# EAGLE design relay_dip_v03 (EAGLE 7.7.0)
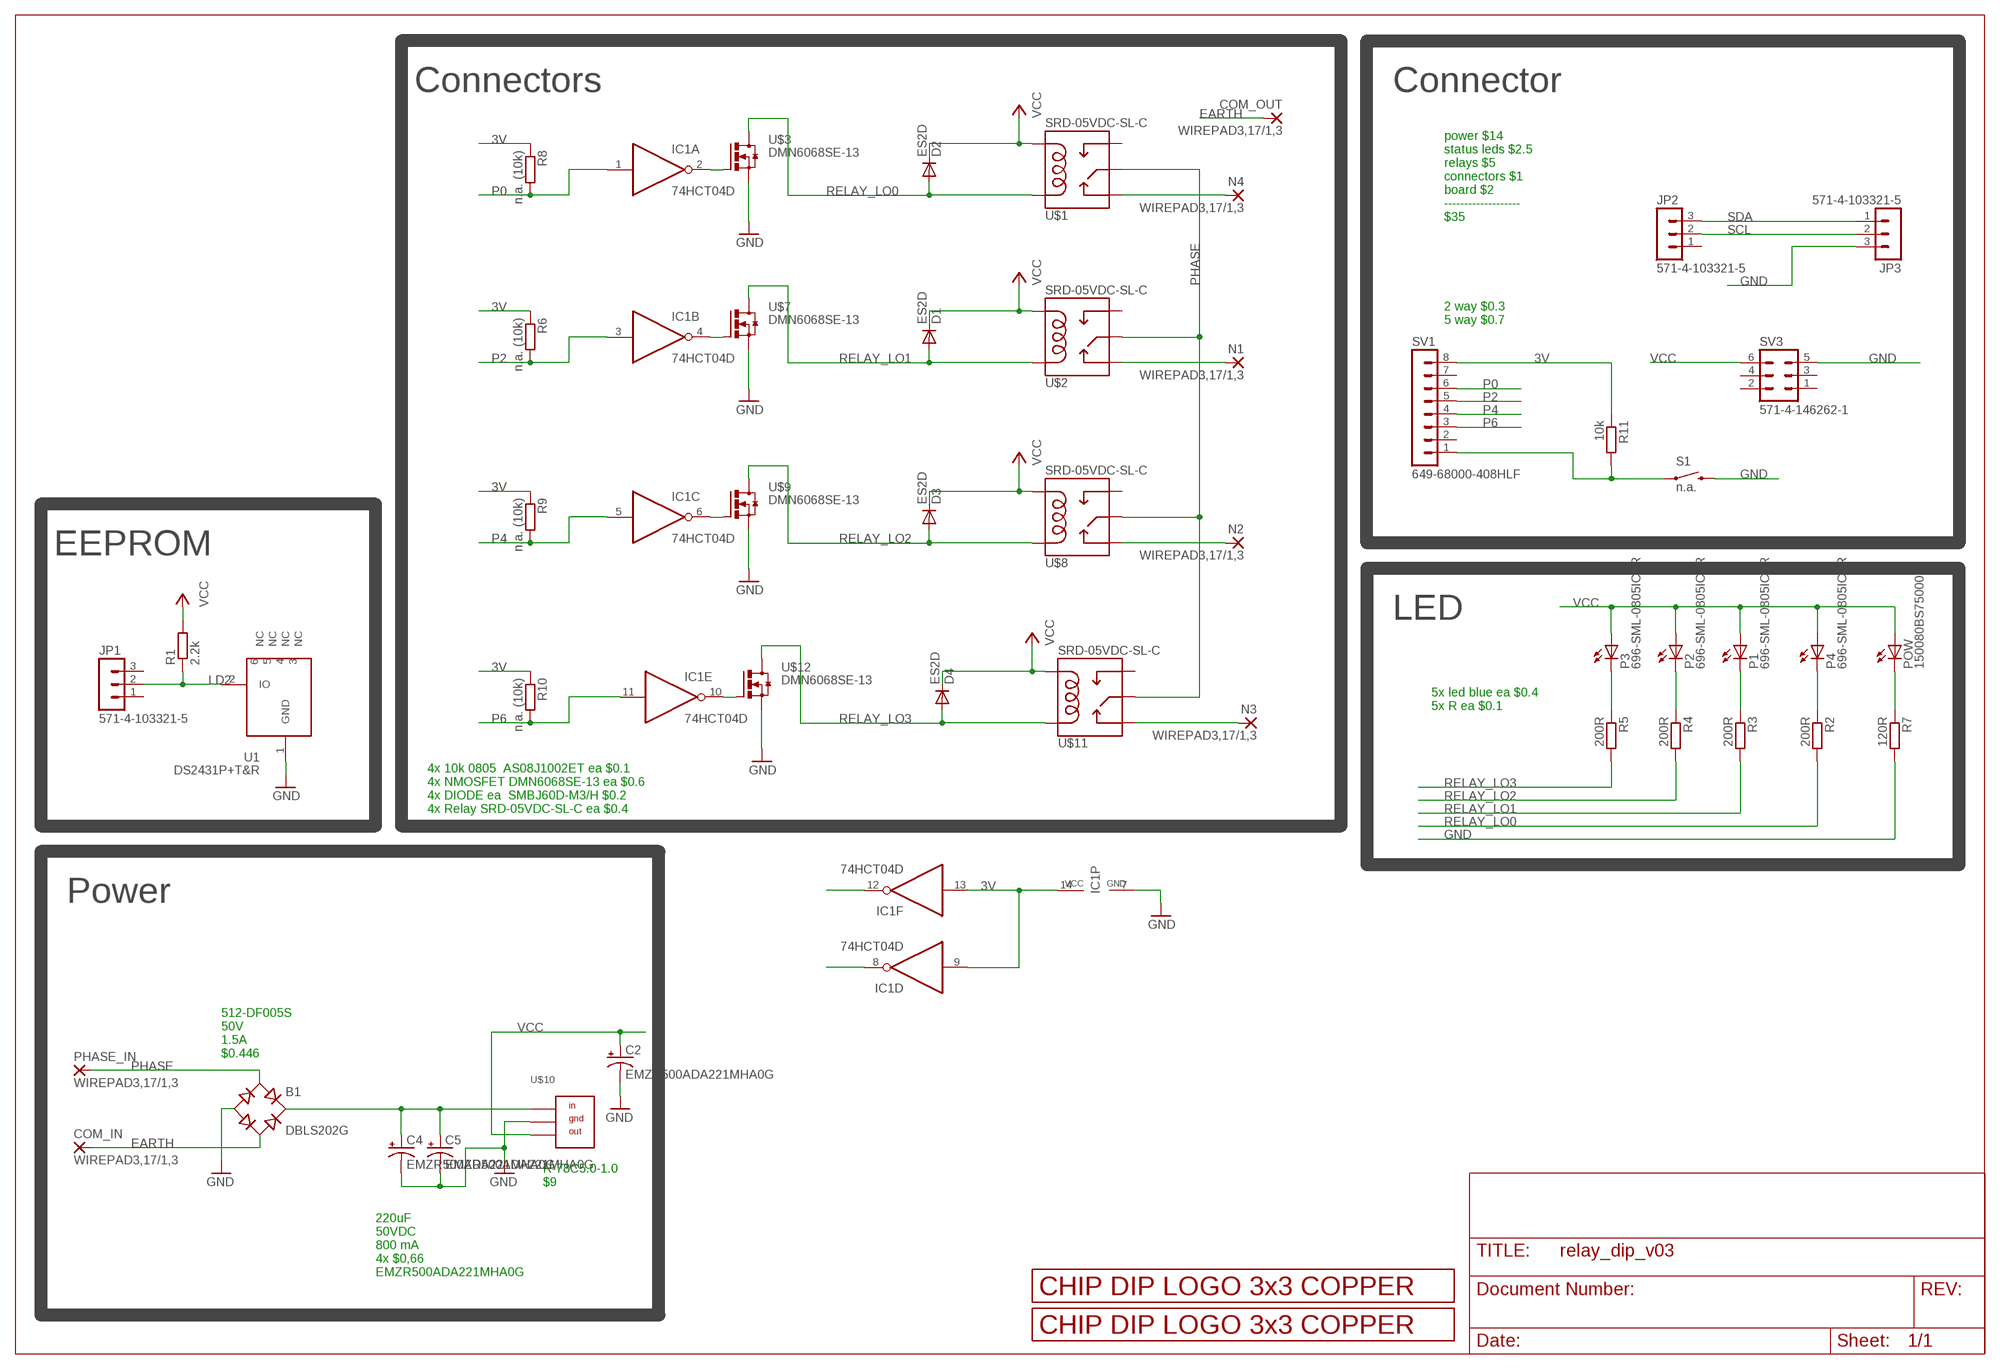
[diagram p0: schematic, sheet 1]

## Parts
B1  DBLS202G  [DBS]
C2  EMZR500ADA221MHA0G  CPOL-US150CLZ-0810  [150CLZ-0810]
C4  EMZR500ADA221MHA0G  CPOL-US150CLZ-0810  [150CLZ-0810]
C5  EMZR500ADA221MHA0G  CPOL-US150CLZ-0810  [150CLZ-0810]
COM_IN  WIREPAD3,17/1,3  [3,17/1,3]
COM_OUT  WIREPAD3,17/1,3  [3,17/1,3]
D1  ES2D  DIODE-SMB  [SMB]
D2  ES2D  DIODE-SMB  [SMB]
D3  ES2D  DIODE-SMB  [SMB]
D4  ES2D  DIODE-SMB  [SMB]
IC1  74HCT04D  [SO14]
JP1  571-4-103321-5  MA03-1  [MA03-1]
JP2  571-4-103321-5  MA03-1  [MA03-1]
JP3  571-4-103321-5  MA03-1  [MA03-1]
N1  WIREPAD3,17/1,3  [3,17/1,3]
N2  WIREPAD3,17/1,3  [3,17/1,3]
N3  WIREPAD3,17/1,3  [3,17/1,3]
N4  WIREPAD3,17/1,3  [3,17/1,3]
P1  696-SML-0805ICTR  LEDCHIP-LED0805  [CHIP-LED0805]
P2  696-SML-0805ICTR  LEDCHIP-LED0805  [CHIP-LED0805]
P3  696-SML-0805ICTR  LEDCHIP-LED0805  [CHIP-LED0805]
P4  696-SML-0805ICTR  LEDCHIP-LED0805  [CHIP-LED0805]
PHASE_IN  WIREPAD3,17/1,3  [3,17/1,3]
POW  150080BS75000  LEDCHIP-LED0805  [CHIP-LED0805]
R1  2.2k  R-EU_R0805  [R0805]
R2  200R  R-EU_R0805  [R0805]
R3  200R  R-EU_R0805  [R0805]
R4  200R  R-EU_R0805  [R0805]
R5  200R  R-EU_R0805  [R0805]
R6  n.a. (10k)  R-EU_R0805  [R0805]
R7  120R  R-EU_R0805  [R0805]
R8  n.a. (10k)  R-EU_R0805  [R0805]
R9  n.a. (10k)  R-EU_R0805  [R0805]
R10  n.a. (10k)  R-EU_R0805  [R0805]
R11  10k  R-EU_R0805  [R0805]
S1  n.a.  SWITCH-MOMENTARY-2SMD  [TACTILE-SWITCH-SMD]
SV1  649-68000-408HLF  MA08-1  [MA08-1]
SV3  571-4-146262-1  MA03-2  [MA03-2]
U1  DS2431P+T&R  DS2431P  [TSOC6]
U$1  SRD-05VDC-SL-C  RELAYPTH  [SRD-05VDC-SL-C]
U$2  SRD-05VDC-SL-C  RELAYPTH  [SRD-05VDC-SL-C]
U$3  DMN6068SE-13  NMOSFET_SMD_223  [SOT223]
U$4  LOGO_3X3_COPPER  [LOGO_3X3_COPPER]
U$6  LOGO_3X3_COPPER  [LOGO_3X3_COPPER]
U$7  DMN6068SE-13  NMOSFET_SMD_223  [SOT223]
U$8  SRD-05VDC-SL-C  RELAYPTH  [SRD-05VDC-SL-C]
U$9  DMN6068SE-13  NMOSFET_SMD_223  [SOT223]
U$10  R-7805-1.0  [SIP3]
U$11  SRD-05VDC-SL-C  RELAYPTH  [SRD-05VDC-SL-C]
U$12  DMN6068SE-13  NMOSFET_SMD_223  [SOT223]

## Nets
3V: IC1.9(D:I) IC1.13(F:I) IC1.14(P:VCC) R6.1 R8.1 R9.1 R10.1 R11.1 SV1.8
EARTH: B1.AC2 COM_IN.1(P) COM_OUT.1(P)
GND: B1.- C2.- C4.- C5.- IC1.7(P:GND) JP3.3 R7.2 S1.3 SV3.5 U1.1(GND) U$3.3(S) U$7.3(S) U$9.3(S) U$10.GND U$12.3(S)
LD2: JP1.2 R1.1 U1.2(IO)
N$1: R11.2 S1.1 SV1.1
N$2: IC1.2(A:O) U$3.1(G)
N$3: P4.C R2.1
N$4: P1.C R3.1
N$5: B1.+ C4.+ C5.+ U$10.IN
N$6: IC1.12(F:O)
N$7: IC1.4(B:O) U$7.1(G)
N$8: P2.C R4.1
N$9: IC1.6(C:O) U$9.1(G)
N$10: P3.C R5.1
N$11: IC1.10(E:O) U$12.1(G)
N$12: IC1.8(D:O)
N$29: POW.C R7.1
NCL: N4.1(P) U$1.SWCLOSED(SWCLOSE)
NCL1: N1.1(P) U$2.SWCLOSED(SWCLOSE)
NCL2: N2.1(P) U$8.SWCLOSED(SWCLOSE)
NCL3: N3.1(P) U$11.SWCLOSED(SWCLOSE)
P0: IC1.1(A:I) R8.2 SV1.6
P2: IC1.3(B:I) R6.2 SV1.5
P4: IC1.5(C:I) R9.2 SV1.4
P6: IC1.11(E:I) R10.2 SV1.3
PHASE: B1.AC1 PHASE_IN.1(P) U$1.SWCOMMON U$2.SWCOMMON U$8.SWCOMMON U$11.SWCOMMON
RELAY_LO0: D2.A R2.2 U$1.COIL1 U$3.2(D) U$3.4(D)
RELAY_LO1: D1.A R3.2 U$2.COIL1 U$7.2(D) U$7.4(D)
RELAY_LO2: D3.A R4.2 U$8.COIL1 U$9.2(D) U$9.4(D)
RELAY_LO3: D4.A R5.2 U$11.COIL1 U$12.2(D) U$12.4(D)
SCL: JP2.2 JP3.2
SDA: JP2.3 JP3.1
VCC: C2.+ D1.C D2.C D3.C D4.C P1.A P2.A P3.A P4.A POW.A R1.2 SV3.6 U$1.COIL0 U$2.COIL0 U$8.COIL0 U$10.OUT U$11.COIL0
Unconnected: JP1.1 JP1.3 JP2.1 SV1.2 SV1.7 SV3.1 SV3.2 SV3.3 SV3.4 U1.3(NC) U1.4(NC) U1.5(NC) U1.6(NC) U$1.SWOPEN U$2.SWOPEN U$8.SWOPEN U$11.SWOPEN

## Notes on the sheet
- Connectors | Connector
- power $14
  status leds $2.5
  relays $5
  connectors $1
  board $2
  -------------------
  $35
- 2 way $0.3
  5 way $0.7
- EEPROM
- LED
- 5x led blue ea $0.4
  5x R ea $0.1
- 4x 10k 0805  AS08J1002ET ea $0.1
  4x NMOSFET DMN6068SE-13 ea $0.6
  4x DIODE ea  SMBJ60D-M3/H $0.2
  4x Relay SRD-05VDC-SL-C ea $0.4
- Power
- 512-DF005S
  50V
  1.5A
  $0.446
- R-78C5.0-1.0
  $9
- 220uF
  50VDC
  800 mA
  4x $0,66
  EMZR500ADA221MHA0G

## Library data of the parts
B1 = rectifier:DB?*G: Single Phase 1.0 AMP Glass Passivated Bridge Rectifier Taiwan Semiconductor Co.,Ltd. - TSC Source: http://www.taiwansemi.com/TSCbig5/ezcatfiles/cust/img/img/db101g.pdf http://www.ts.com.tw/db/pictures/modules/PDT/PDT060207001/DBLS201G.pdf
C2 C4 C5 = rcl:CPOL-US: POLARIZED CAPACITOR, American symbol
COM_IN COM_OUT N1-N4 PHASE_IN = wirepad:WIREPAD: Wire PAD connect wire on PCB
D1-D4 = diode:DIODE-: DIODE
IC1 = 74xx-eu:74*04: Hex INVERTER
JP1-JP3 = con-lstb:MA03-1: PIN HEADER; OC_FARNELL: unknown; OC_NEWARK: unknown
P1-P4 POW = led:LED: LED OSRAM: - CHIPLED LG R971, LG N971, LY N971, LG Q971, LY Q971, LO R971, LY R971 LH N974, LH R974 LS Q976, LO Q976, LY Q976 LO Q996 - Hyper CHIPLED LW Q18S LB Q993, LB Q99A, LB R99A - SideLED LS A670, LO A670, LY A670, LG A670, LP A670 LB A673, LV A673, LT A673, LW A673 LH A674 LY A675 LS A676, LA A676, LO A676, LY A676, LW A676 LS A679, LY A679, LG A679 - Hyper Micro SIDELED® LS Y876, LA Y876, LO Y876, LY Y876 LT Y87S - SmartLED LW L88C, LW L88S LB L89C, LB L89S, LG L890 LS L89K, LO L89K, LY L89K LS L896, LA L896, LO L896, LY L896 - TOPLED LS T670, LO T670, LY T670, LG T670, LP T670 LSG T670, LSP T670, LSY T670, LOP T670, LYG T670 LG T671, LOG T671, LSG T671 LB T673, LV T673, LT T673, LW T673 LH T674 LS T676, LA T676, LO T676, LY T676, LB T676, LH T676, LSB T676, LW T676 LB T67C, LV T67C, LT T67C, LS T67K, LO T67K, LY T67K, LW E67C LS E67B, LA E67B, LO E67B, LY E67B, LB E67C, LV E67C, LT E67C LW T67C LS T679, LY T679, LG T679 LS T770, LO T770, LY T770, LG T770, LP T770 LB T773, LV T773, LT T773, LW T773 LH T774 LS E675, LA E675, LY E675, LS T675 LS T776, LA T776, LO T776, LY T776, LB T776 LHGB T686 LT T68C, LB T68C - Hyper Mini TOPLED® LB M676 - Mini TOPLED Santana® LG M470 LS M47K, LO M47K, LY M47K Source: http://www.osram.convergy.de LUXEON: - LUMILED® LXK2-PW12-R00, LXK2-PW12-S00, LXK2-PW14-U00, LXK2-PW14-V00 LXK2-PM12-R00, LXK2-PM12-S00, LXK2-PM14-U00 LXK2-PE12-Q00, LXK2-PE12-R00, LXK2-PE12-S00, LXK2-PE14-T00, LXK2-PE14-U00 LXK2-PB12-K00, LXK2-PB12-L00, LXK2-PB12-M00, LXK2-PB14-N00, LXK2-PB14-P00, LXK2-PB14-Q00 LXK2-PR12-L00, LXK2-PR12-M00, LXK2-PR14-Q00, LXK2-PR14-R00 LXK2-PD12-Q00, LXK2-PD12-R00, LXK2-PD12-S00 LXK2-PH12-R00, LXK2-PH12-S00 LXK2-PL12-P00, LXK2-PL12-Q00, LXK2-PL12-R00 Source: www.luxeon.com KINGBRIGHT: KA-3528ASYC Source: www.kingbright.com
R1-R11 = rcl:R-EU_: RESISTOR, European symbol
S1 = SparkFun-Electromechanical:SWITCH-MOMENTARY-2: Various NO switches- pushbuttons, reed, etc; PROD_ID: SWCH-08247
SV1 = con-lstb:MA08-1: PIN HEADER; OC_FARNELL: unknown; OC_NEWARK: unknown
SV3 = con-lstb:MA03-2: PIN HEADER; OC_FARNELL: unknown; OC_NEWARK: unknown
U1 = JKW_CHIP:DS2431: 1024-Bit EEPROM This chip provides a 4x256 Bit EEPROM, which can be programmed@5V. Write protection and OTP emulation are available, too. Author: Jan Kandziora <jjj@gmx.de>; DESCRIPTION: IC, 1024-Bit, 1-Wire EEPROM, TSOC6; FOOTPRINT: TSOC6; LINK: http://www.digikey.com/product-detail/en/DS2431P%2BT%26R/DS2431P%2BT%26RCT-ND/3647900; MFG: DIGIKEY; MFG_PN: DS2431P+T&RCT-ND; PART_TYPE: IC; PRICE: 0.98; VENDOR: MAXIM; VENDOR_PART_NUMBER: DS2431P+T&R
U$1 U$2 U$8 U$11 = SRD-05VDC-SL-C:RELAY: SPDT relay (COM-00101)
U$3 U$7 U$9 U$12 = transistor-power:NMOSFET_SMD_223
U$4 U$6 = logo:LOGO_3X3_COPPER
U$10 = Kolja:R-7805-1.0

## Board
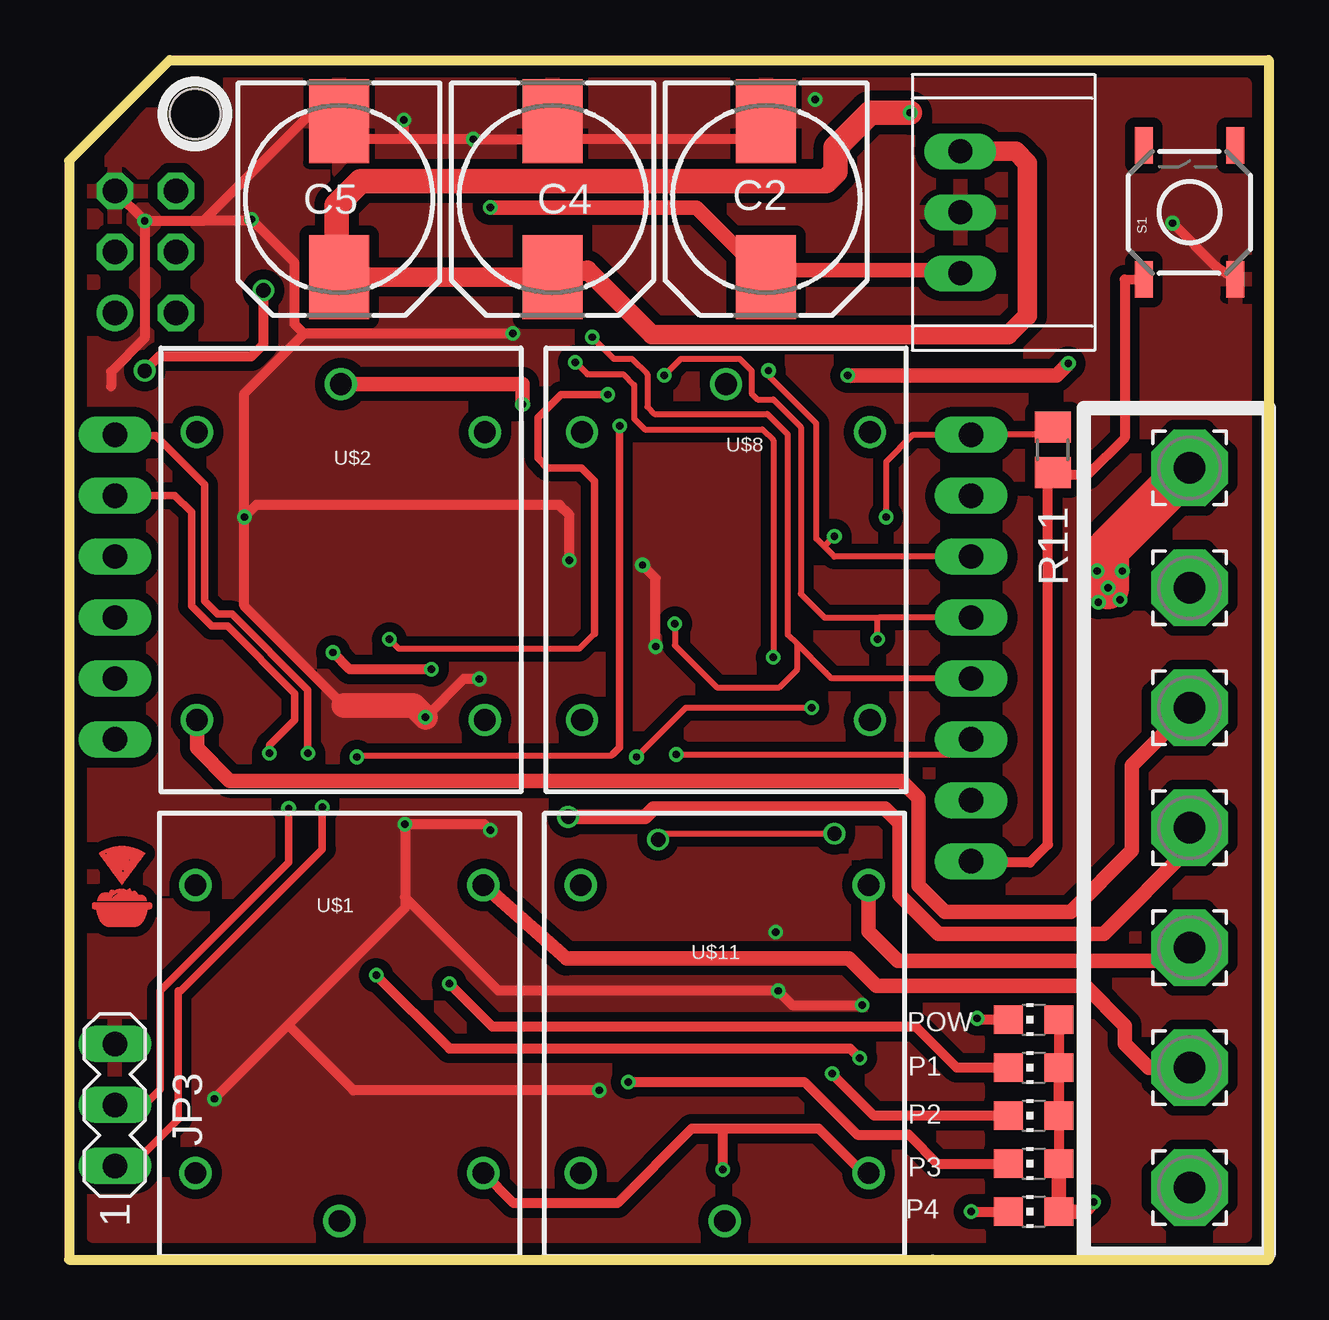
[diagram p1: board, top side]
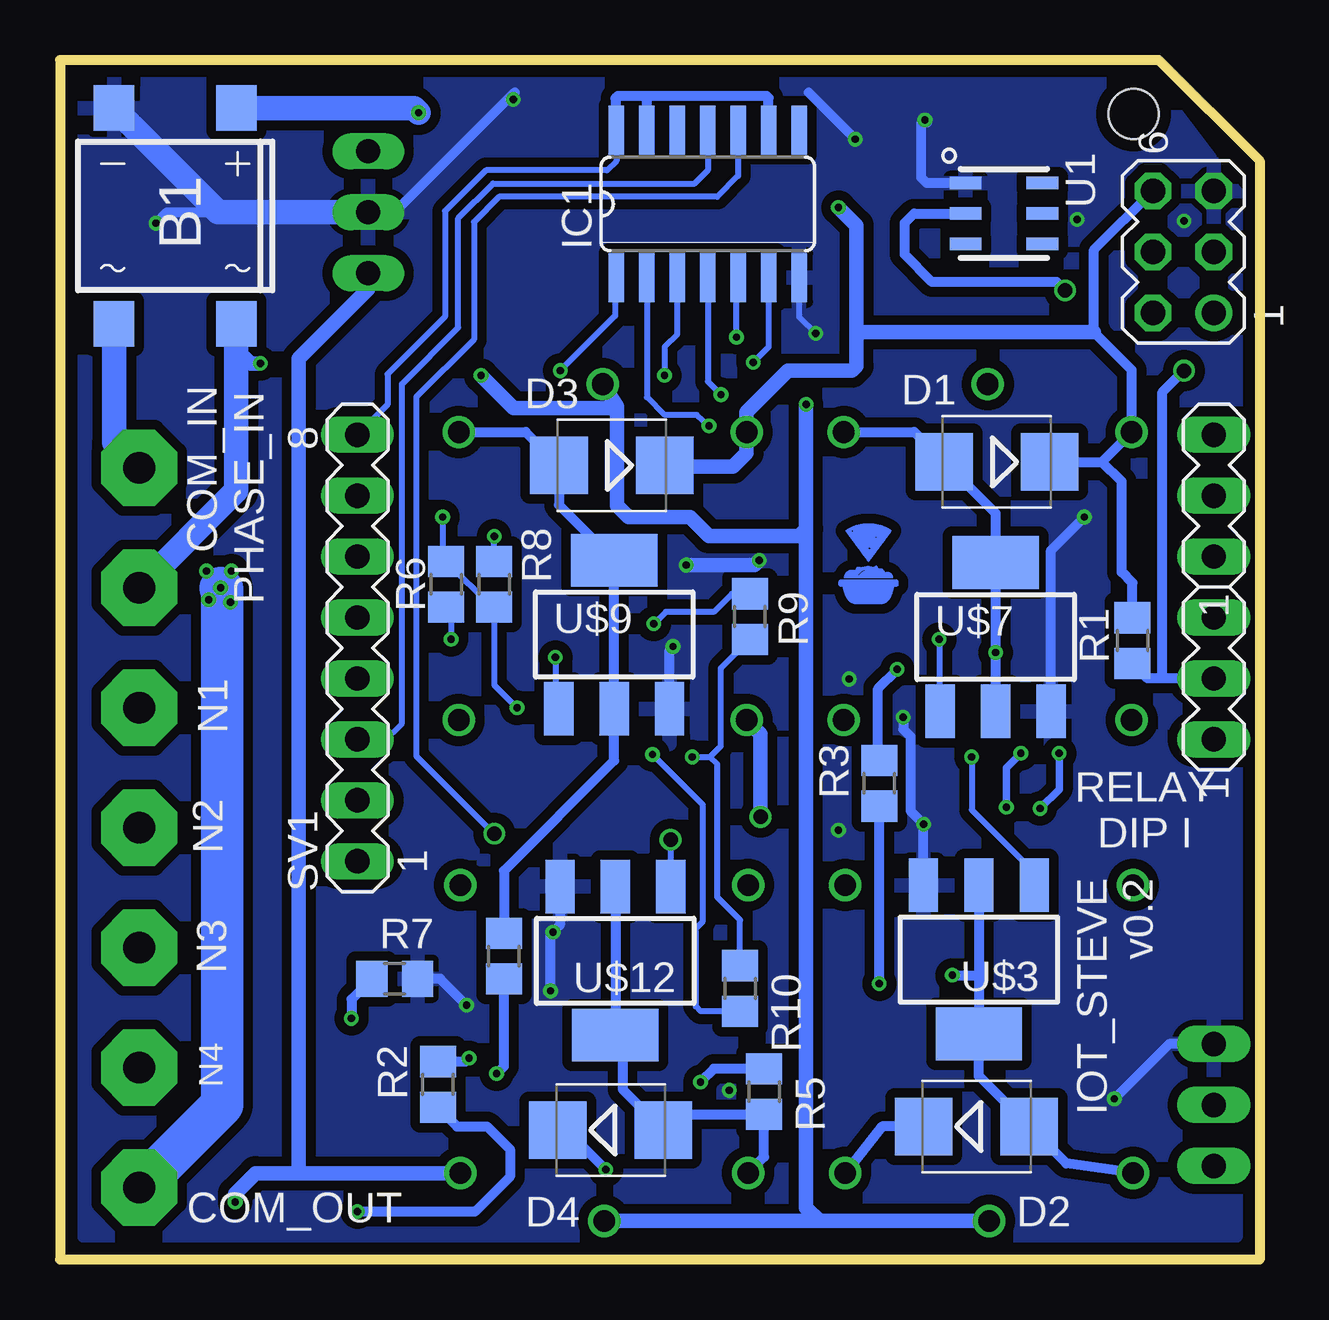
[diagram p2: board, bottom side, seen from below]

Size 50 x 50 mm. Coordinates in mm from the lower left corner, seen from the top.
Outline: 4.2,50 50,50 50,0 0,0 0,45.8 4.2,50
Copper layers (1*16): Top 0.035mm / dielectric 1.6mm / Bottom 0.035mm
Design rules "Elecrow_2-layer_PCB_eagle_rule": minimum track width 6mil, minimum drill 12mil, track to track 6mil, track to pad 6mil, pad to pad 6mil, via to via 8mil, smd to smd 0mil, copper to edge 20mil, drill to drill 10mil, minimum pad ring 6mil, minimum via ring 6mil, stop-mask expansion 0mil, vias tented up to drill 100mil, thermal gap 10mil
Holes 2.1 mm at 5.25,47.75

### Footprints (pad centres in the part's own frame; a part is rotated, then mirrored left to right if it is on the bottom)
DBS = smd 1.7 x 1.9: + -2.55,-4.5; - 2.55,-4.5; AC1 -2.55,4.5; AC2 2.55,4.5
150CLZ-0810 = smd 3.5 x 2.5: + 3.25,0; - -3.25,0
3,17/1,3 = drill 1.321 pad 3.175 octagon: 1 0,0
SMB = smd 2.4 x 2.4: A 2.2,0; C -2.2,0
SO14 = smd 0.66 x 2.032: 1 -3.81,-3.073; 2 -2.54,-3.073; 3 -1.27,-3.073; 4 0,-3.073; 5 1.27,-3.073; 6 2.54,-3.073; 7 3.81,-3.073; 8 3.81,3.073; 9 2.54,3.073; 10 1.27,3.073; 11 0,3.073; 12 -1.27,3.073; 13 -2.54,3.073; 14 -3.81,3.073
MA03-1 = drill 1.016 long: 1 -2.54,0; 2 0,0; 3 2.54,0
CHIP-LED0805 = smd 1.2 x 1.2: A 0,-1.05; C 0,1.05
R0805 = smd 1.3 x 1.5: 1 -0.95,0; 2 0.95,0
TACTILE-SWITCH-SMD = smd 1.524 x 0.762: 1 -2.794,1.905; 2 2.794,1.905; 3 -2.794,-1.905; 4 2.794,-1.905
MA08-1 = drill 1.016 long: 1 -8.89,0; 2 -6.35,0; 3 -3.81,0; 4 -1.27,0; 5 1.27,0; 6 3.81,0; 7 6.35,0; 8 8.89,0
MA03-2 = drill 1.016: 1 -2.54,-1.27 | drill 1.016 octagon: 2 -2.54,1.27; 3 0,-1.27; 4 0,1.27; 5 2.54,-1.27; 6 2.54,1.27
TSOC6 = smd 0.53 x 1.33: 1 -1.27,-1.6; 2 0,-1.6; 3 1.27,-1.6; 4 1.27,1.6; 5 0,1.6; 6 -1.27,1.6
SRD-05VDC-SL-C = drill 0.9: COIL0 -5.39,-6.12; COIL1 -5.39,5.88; SWCLOSED 6.61,-6.12; SWCOMMON -7.39,-0.12; SWOPEN 6.61,5.88
SOT223 = smd 1.219 x 2.235: 1 -2.311,-3.099; 2 0,-3.099; 3 2.311,-3.099 | smd 3.6 x 2.2: 4 0,3.099
SIP3 = drill 1 long: GND 5.75,2; IN 3.21,2; OUT 8.29,2

### Placement (x,y rotation side)
B1  45.2,43.5 180 bottom
C2  29.05,44.2 270 top
C4  20.15,44.2 270 top
C5  11.25,44.2 270 top
COM_IN  46.7,33 90 top
COM_OUT  46.7,3 90 top
D1  10.95,33.25 180 bottom
D2  11.8,5.55 0 bottom
D3  27,33.1 180 bottom
D4  27.05,5.4 0 bottom
IC1  23,44 0 bottom
JP1  1.91,24.22 90 bottom
JP2  1.91,31.84 90 bottom
JP3  1.91,6.44 90 top
N1  46.7,23 0 top
N2  46.7,18 0 top
N3  46.7,13 0 top
N4  46.7,8 90 top
P1  40.2,8 90 top
P2  40.2,6 90 top
P3  40.2,4 90 top
P4  40.2,2 90 top
PHASE_IN  46.7,28 90 top
POW  40.2,10 90 top
R1  5.3,25.8 90 bottom
R2  34.25,7.3 90 bottom
R3  15.85,19.85 90 bottom
R4  31.5,12.65 90 bottom
R5  20.65,7 270 bottom
R6  33.9,28.15 270 bottom
R7  36.05,11.7 0 bottom
R8  31.9,28.15 90 bottom
R9  21.25,26.8 90 bottom
R10  21.65,11.3 270 bottom
R11  41,33.75 270 top
S1  46.7,43.65 90 top
SV1  37.6,25.49 90 bottom
SV3  3.17,42 90 bottom
U1  10.65,43.6 270 bottom
U$1  11.15,9 90 top
U$2  11.45,29.1 270 top
U$3  11.7,12.5 180 bottom
U$4  2.2,15.55 0 top
U$6  16.3,29 0 bottom
U$7  11,25.95 0 bottom
U$8  27.5,29.1 270 top
U$9  26.9,26.05 0 bottom
U$10  35.15,49.4 270 top
U$11  27.2,9 90 top
U$12  26.85,12.45 180 bottom

### Tracks (layer width: path | path; a pad name or v marks a point on that pad's centre or on a via)
3V  (via drill 0.3)
  Top 0.254: v34.05,30.95 34.05,33.25 35.18,34.38 SV1.8 40.68,34.38 | v30.95,23 25.7,23 v23.65,20.95
  Top 0.406: 40.68,34.38 R11.1
  Bottom 0.254: IC1.14 26.81,45.79 27.2,45.4 32.25,45.4 33.95,43.7 33.95,39.3 36.35,36.9 36.35,35.63 SV1.8 | v34.05,30.95 34.05,29.25 R6.1 32,27.2 R8.1 31.9,23.95 v30.95,23 | v23.65,20.95 22.9,20.95 | 22.9,20.95 22.45,21.4 22.45,24.65 R9.1 | R10.1 21.65,14.15 22.6,15.1 22.6,20.65 22.9,20.95
  Bottom 0.406: IC1.9 20.46,48.41 20.55,48.5 25.6,48.5 | 25.6,48.5 26.75,48.5 26.85,48.4 26.85,47.11 IC1.14 | IC1.13 25.54,48.44 25.6,48.5
EARTH  (via drill 0.3)
  Top 1.778: v43.3,28 43.3,29.6 COM_IN.1
  Bottom 0.406: v42.9,27.4 42.9,27.6 v43.3,28 | v43.3,28 43.3,28.1 | 43.3,28.1 v43.9,28.7 | v43.8,27.5 v43.3,28 | 43.3,28.1 43.3,28.25 v42.85,28.7
  Bottom 0.813: 45.7,3 COM_OUT.1
  Bottom 1.016: B1.AC2 47.75,34.05 COM_IN.1
  Bottom 1.778: COM_OUT.1 43.25,6.45 43.25,27.95 v43.3,28
GND  (via drill 0.3)
  Top 0.406: v3.15,43.3 3.19,43.25 3.29,43.35 3.35,43.3 5.6,43.3 | v3.15,43.3 3.15,38.4 1.75,37 1.75,36.4 | 11.45,23.1 7.3,27.25 v7.3,30.95 | v33.05,10.6 30.15,10.6 v29.55,11.2 17.9,11.2 14,15.1 | 5.6,43.3 10.05,47.75 C5.- 12.3,46.7 14,46.7 | 19.1,46.7 v16.85,46.7 14,46.7 | 19.1,46.7 C4.- | v13.95,47.5 13.95,46.75 14,46.7 | 5.6,43.3 7.55,43.3 v7.6,43.35 9.4,41.55 9.4,39 9.8,38.6 | v18.5,38.6 9.8,38.6 | v7.3,30.95 7.3,36.1 9.8,38.6 | v17.55,17.9 17.3,18.15 v14,18.15 14,15.1 | 14,15.1 14,14.65 9.12,9.78 | 9.12,9.78 v6.05,6.7 | v22.1,7.05 11.85,7.05 9.12,9.78 | v24.45,25.55 24.45,28.4 v23.9,28.95 | v17.1,24.2 16.45,24.2 v14.85,22.6 | v20.85,29.15 20.85,31.05 20.45,31.45 7.8,31.45 v7.3,30.95 | S1.3 47.8,41.4 v46,43.2 | C2.- 28,46.7 19.1,46.7 | SV3.5 v3.15,43.3
  Top 1.016: v14.85,22.6 14.35,23.1 11.45,23.1
  Bottom 0.254: IC1.7 19.19,39.29 v18.5,38.6
  Bottom 0.406: U$10.GND 36.05,43.65 31.05,48.65 | 18.8,48.65 v16.85,46.7 | 13.85,47.4 v13.95,47.5 14.1,47.35 14.1,45.1 13.87,44.87 U1.1 | v14.85,22.6 14.85,22.1 14.55,21.8 14.55,18.7 14.01,18.16 | 14.01,18.16 v14,18.15 | JP3.3 3.77,8.98 v6.05,6.7 | U$3.3 14.01,18.16 | v29.55,11.2 29.55,13.55 v29.45,13.65 29.16,13.94 U$12.3 | U$9.3 24.59,25.41 v24.45,25.55 | 21.05,28.95 v20.85,29.15 | U$7.3 8.69,29.56 v7.3,30.95 | v46,43.2 45.55,43.65 43.25,43.65 | v33.05,10.6 34.15,11.7 R7.2
  Bottom 0.61: 20.9,29.1 21.05,28.95 v23.9,28.95
  Bottom 1.016: B1.- 43.4,43.65 43.25,43.65 U$10.GND
  other vias: 31.1,48.35
  pour Top (isolate 0.406): 1,1 1,45 4.4,49 49,49 49,1
  pour Bottom (isolate 0.406): 1,1 49,1 49,49 4.4,49 1,44.5
LD2  (via drill 0.6)
  Top 0.406: v3.15,37.05 3.75,37.65 7.6,37.65 8.1,38.15 v8.1,40.4
  Bottom 0.406: JP1.2 4.2,24.22 | 4.2,24.22 4.67,24.22 R1.1 | 4.2,24.22 4.05,24.37 4.05,36.15 v3.15,37.05 | v8.1,40.4 8.45,40.75 13.65,40.75 14.8,41.9 14.8,43.2 14.4,43.6 U1.2
N$1
  Top 0.254: 37.65,16.55 SV1.1
  Top 0.406: 37.65,16.55 40.05,16.55 40.8,17.3 40.8,32.6 R11.2 41.1,32.7 42.45,32.7 44,34.25 44,40.85 S1.1
N$2  (via drill 0.3)
  Top 0.254: 22.7,21.1 22.6,21 12.05,21 v12,20.95
  Top 0.305: 22.7,21.1 22.95,21.35 v22.95,34.75
  Bottom 0.254: IC1.2 25.54,35.94 24.8,35.2 23.45,35.2 v22.95,34.75 | v12,20.95 12,18.75 9.39,16.14 U$3.1
N$3  (via drill 0.3)
  Top 0.406: v37.6,2 P4.C
  Bottom 0.406: R2.1 33.45,5.55 32.2,5.55 31.25,4.6 31.25,3.45 32.7,2 v37.6,2
N$4  (via drill 0.3)
  Top 0.406: P1.C 37,8 35.3,9.7 17.65,9.7 v15.85,11.5
  Bottom 0.406: v15.85,11.5 R3.1
N$5  (via drill 0.3)
  Top 0.813: C5.+ C4.+ 21.6,41.25 24.3,38.55 39.15,38.55 39.95,39.35 39.95,45.7 39.46,46.19 U$10.IN
  Top 1.016: v35.05,47.8 33.4,47.8 31.95,46.35 31.95,45.35 31.55,44.95 12.15,44.95 11.15,43.95 11.15,41.35 C5.+
  Bottom 1.016: B1.+ 35.25,48 v35.05,47.8
N$7  (via drill 0.3)
  Top 0.254: 21.9,26.1 21.25,25.45 13.75,25.45 v13.35,25.85
  Top 0.305: 21.9,26.1 21.9,32.45 21.35,33 19.95,33 19.55,33.4 19.55,35.1 20.5,36.05 v22.45,36.05
  Bottom 0.254: IC1.4 23,36.6 v22.45,36.05 | v13.35,25.85 13.35,22.89 U$7.1
N$8  (via drill 0.3)
  Top 0.406: P2.C 33.55,6 v31.8,7.75
  Bottom 0.406: v31.8,7.75 31.5,8.05 R4.1
N$9  (via drill 0.3)
  Top 0.254: v21.1,37.4 21.6,36.9 23.1,36.9 23.55,36.45 23.55,35.05 24,34.6 28.9,34.6 29.35,34.15 v29.35,25.1
  Bottom 0.254: IC1.6 20.46,38.04 v21.1,37.4 | v29.35,25.1 29.35,23.09 U$9.1
N$10  (via drill 0.3)
  Top 0.406: v23.3,7.4 30.65,7.4 32.85,5.2 35,5.2 36.2,4 P3.C
  Bottom 0.406: R5.1 22.75,7.95 v23.3,7.4
N$11  (via drill 0.6)
  Top 0.254: v31.9,17.75 24.8,17.75 v24.55,17.5
  Bottom 0.254: v24.55,17.5 U$12.1 | IC1.10 21.73,45.17 22.6,44.3 31.7,44.3 32.75,43.25 32.75,38.35 35.15,35.95 35.15,21 v31.9,17.75
N$29  (via drill 0.3)
  Top 0.406: POW.C 37.9,10 v37.85,10.05
  Bottom 0.406: R7.1 37.85,10.85 v37.85,10.05
NCL
  Top 0.61: N4.1 45,8 44,9 44,9.75 42.35,11.4 33.65,11.4 32.5,12.55 20.73,12.55 U$1.SWCLOSED
NCL1
  Top 0.61: U$2.SWCLOSED 5.33,21.32 6.7,19.95 34.7,19.95 35.4,19.25 35.4,15.6 36.5,14.5 41.75,14.5 44.3,17.05 44.3,20.6 N1.1
NCL2  (via drill 0.6)
  Top 0.61: v20.8,18.45 24,18.45 24.35,18.8 34,18.8 34.6,18.2 34.6,15.2 36.23,13.57 43.12,13.57 46.7,17.15 N2.1
  Bottom 0.61: v20.8,18.45 20.8,21.91 U$8.SWCLOSED
NCL3
  Top 0.61: N3.1 46.15,12.45 34.55,12.45 33.32,13.68 U$11.SWCLOSED
P0  (via drill 0.3)
  Top 0.254: 31.43,29.77 31.15,30.05 31.15,34.85 29.15,36.85 v29.15,37.05 | v31.9,30.15 31.52,29.77 31.43,29.77 | SV1.6 31.9,29.3 31.43,29.77
  Bottom 0.254: R8.2 v31.9,30.15 | v29.15,37.05 26.86,39.34 26.86,40.88 IC1.1
P2  (via drill 0.3)
  Top 0.254: v33.7,25.85 33.7,26.7 | 33.7,26.7 33.7,26.76 31.49,26.76 30.5,27.75 30.5,34.7 29.35,35.85 28.7,35.85 28.45,36.1 28.45,37.05 27.95,37.55 25.5,37.55 v24.8,36.85 | SV1.5 33.76,26.76 33.7,26.7
  Bottom 0.254: IC1.3 24.27,38.58 24.8,38.05 v24.8,36.85 | R6.2 33.7,27 v33.7,25.85
P4  (via drill 0.3)
  Top 0.254: 30.35,25.65 29.95,26.05 29.95,34.4 29.1,35.25 24.4,35.25 24.1,35.55 24.1,36.9 23.45,37.55 22.7,37.55 v21.8,38.45 | 30.35,25.65 31.55,24.45 31.78,24.22 SV1.4 | v25.25,26.5 25.25,25.6 27,23.85 29.6,23.85 30.35,24.6 30.35,25.65
  Bottom 0.254: v21.8,38.45 21.8,40.86 IC1.5 | R9.2 22,27.75 22.75,27 24.75,27 v25.25,26.5
P6  (via drill 0.3)
  Top 0.254: v25.3,21.05 36.97,21.05 SV1.3
  Bottom 0.254: IC1.11 23,45.4 23.55,44.85 31.95,44.85 33.4,43.4 33.4,38.85 35.75,36.5 35.75,22.35 36.55,21.55 37.47,21.55 SV1.3 | R10.2 23.3,10.35 23.5,10.55 23.5,13.8 23.2,14.1 23.2,18.95 v25.3,21.05
PHASE  (via drill 0.3)
  Top 0.61: U$2.SWCOMMON 18.9,36.49 v18.9,35.65 | v32.45,36.85 41.15,36.85 v41.65,37.35
  Bottom 0.61: 18.9,30.45 18.9,2.16 18.35,1.61 | 18.9,30.45 v18.9,35.65 | U$8.SWCOMMON 26.78,35.55 | 26.78,35.55 26.78,31.43 26.3,30.95 23.75,30.95 22.95,30.15 19.2,30.15 18.9,30.45 | v32.45,36.85 31.1,35.5 26.83,35.5 26.78,35.55 | v41.65,37.35 42.05,37.35 42.65,37.95 | U$1.SWCOMMON 18.35,1.61 | U$11.SWCOMMON 18.35,1.61
  Bottom 1.016: B1.AC1 42.65,37.95 42.65,32.05 PHASE_IN.1
RELAY_LO0  (via drill 0.3)
  Top 0.406: v12.8,11.85 15.85,8.8 32.55,8.8 v32.95,8.4
  Bottom 0.406: U$3.2 11.7,11.85 | 11.7,11.85 U$3.4 11.7,7.65 D2.A 8.06,4.01 U$1.COIL1 | v12.8,11.85 11.7,11.85 | v32.95,8.4 33.1,8.25 R2.2
RELAY_LO1  (via drill 0.3)
  Top 0.406: v15.1,24.6 11.7,24.6 v11,25.3
  Bottom 0.406: U$2.COIL1 14.39,34.49 D1.A 11,31.1 U$7.4 v11,25.3 U$7.2 10.95,22.8 | v15.1,24.6 15.9,23.8 15.9,20.85 R3.2
RELAY_LO2
  Bottom 0.406: U$8.COIL1 30.59,34.49 D3.A 29.2,31.45 U$9.4 U$9.2 26.9,20.8 31.5,16.2 R4.2
RELAY_LO3
  Bottom 0.406: U$12.2 U$12.4 | U$12.4 26.85,9.2 26.55,8.9 26.55,7.1 D4.A 24.2,6.05 R5.2 | 27.2,9 U$12.4 | R5.2 20.72,5.98 | U$11.COIL1 20.65,4.28 R5.2
SCL  (via drill 0.3)
  Top 0.305: JP3.2 3.15,6.45 3.8,7.1 3.8,11.2 9.15,16.55 v9.15,18.8 | JP2.2 4.41,31.84 5.1,31.15 5.1,27.25 5.95,26.4 6.6,26.4 9.4,23.6 9.4,22.5 8.35,21.45 v8.35,21.1
  Bottom 0.305: v8.35,21.1 8.35,19.6 v9.15,18.8
SDA  (via drill 0.3)
  Top 0.305: JP3.1 2.6,3.9 4.55,5.85 4.55,11.2 4.65,11.2 10.55,17.1 v10.55,18.85 | v9.95,21.1 9.95,23.75 6.8,26.9 6.2,26.9 5.65,27.45 5.65,32.3 3.6,34.35 1.94,34.35 JP2.3
  Bottom 0.305: v10.55,18.85 10.55,20.5 v9.95,21.1
VCC  (via drill 0.3)
  Top 0.406: POW.A P1.A | P2.A P1.A | P1.A P3.A | 27.1,5.45 31.25,5.45 33.09,3.61 U$11.COIL0 | 27.1,5.45 25.95,5.45 22.85,2.35 18.53,2.35 U$1.COIL0 | v27.25,3.75 27.25,5.3 27.1,5.45
  Top 0.61: U$10.OUT 37.01,41.25 29.35,41.25 C2.+ 26.15,43.85 v17.55,43.85 | P3.A P4.A 42.3,2 v42.7,2.4
  Bottom 0.406: 24.75,33.05 D3.C | D1.C 6.57,33.25 | 6.57,33.25 U$2.COIL0 5.33,37.08 6.9,38.65 6.9,42.09 SV3.6 | D2.C 15.73,5.55 U$1.COIL0 | D4.C 28.9,5.4 v27.25,3.75 | R1.2 5.3,28.2 5.75,28.65 5.75,32.43 6.57,33.25
  Bottom 0.61: 6.9,38.65 16.75,38.65 16.8,38.7 | 40.15,3.6 41.85,3.6 42.7,2.75 v42.7,2.4 | 40.15,3.6 33.13,3.6 U$11.COIL0 | v17.55,43.85 16.8,43.1 16.8,38.7 | 16.8,38.7 16.8,37.25 17,37.05 19.65,37.05 21.38,35.32 U$8.COIL0 21.38,33.62 21.95,33.05 24.75,33.05 | U$10.OUT 37.15,40.45 40.05,37.55 40.05,3.7 40.15,3.6

### Text on the board
bPlace: RELAY / DIP I | IOT_STEVE / v0.2